# Altium project PCB_Project_1.PrjPcb
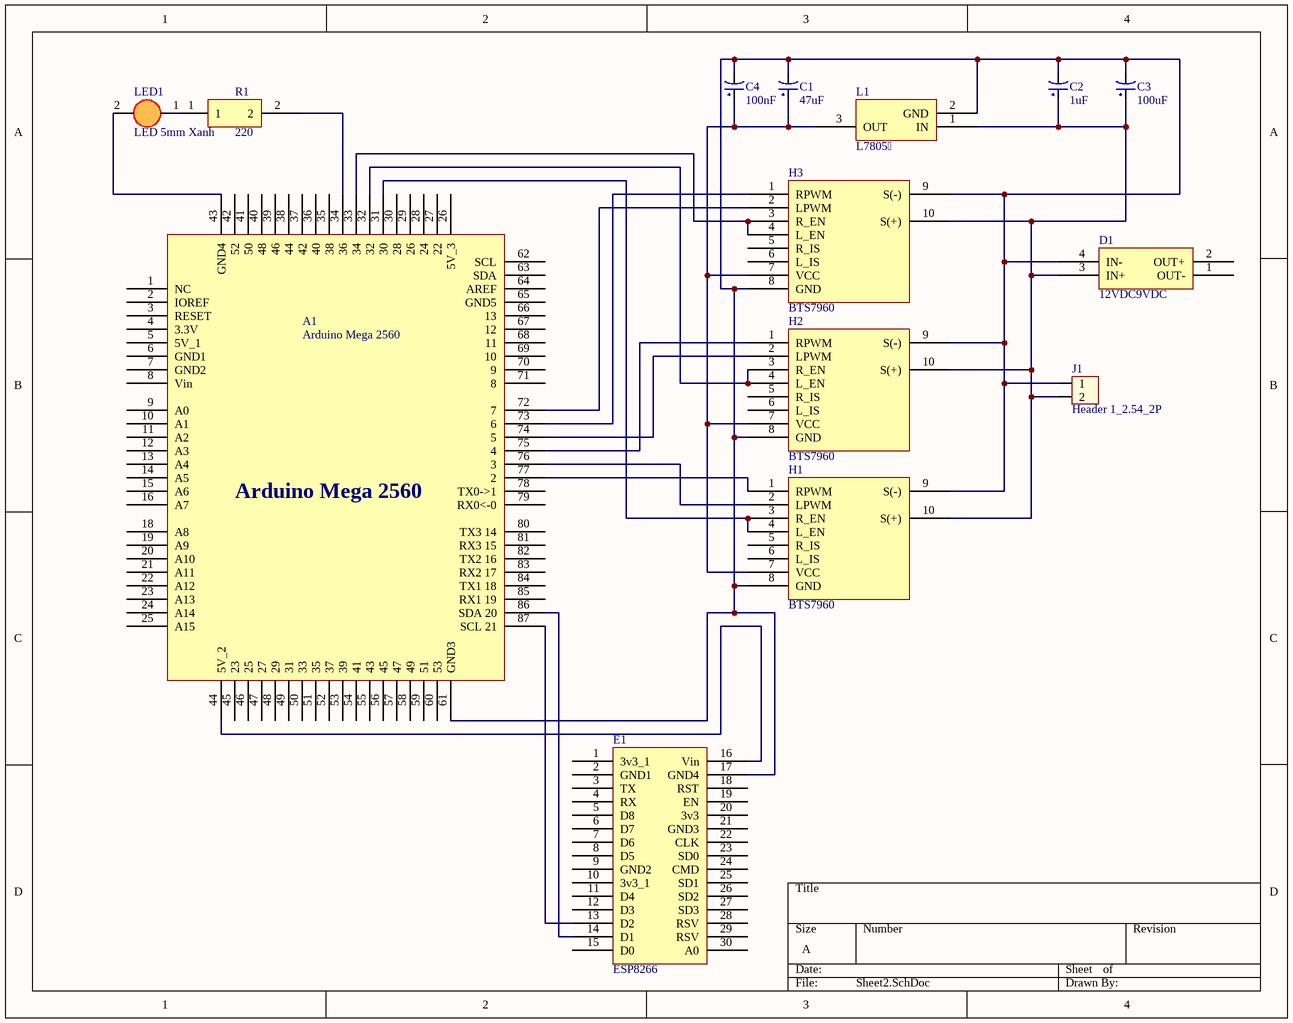
[diagram p0: Sheet2.SchDoc]
1 sheet, 14 parts. Net scope: global (net labels, ports and power ports of the same name join across sheets).
Board file: PCB1.PcbDoc

## Sheet Sheet2.SchDoc
size A; SheetNumber: 1; SheetTotal: 1

### Parts
A1  Arduino Mega 2560  [ArduinoMega2560]
C1  47uF  [tu hoa 5mm]
C2  1uF  [tu hoa 5mm]
C3  100uF  [tu hoa 5mm]
C4  100nF  [tu hoa 5mm]
D1  12VDC9VDC  [LM2596]
E1  ESP8266  [ESP8266]
H1  BTS7960  [BTS7960]
H2  BTS7960  [BTS7960]
H3  BTS7960  [BTS7960]
J1  Header 1_2.54_2P  [Header_Duc Cong_2P 2.54]
L1  L7805  [L7806]
LED1  LED 5mm Xanh  [LED 5mm Xanh]
R1  220  [Res]

### Nets
NetA1_31: A1.31(30) H1.3(R_EN) H1.4(L_EN)
NetA1_32: A1.32 H2.3(R_EN) H2.4(L_EN)
NetA1_33: A1.33(34) H3.3(R_EN) H3.4(L_EN)
NetA1_34: A1.34(36) R1.2
NetA1_43: A1.43(GND4) LED1.2(K)
NetA1_44: A1.44(5V_2) E1.16(Vin)
NetA1_61: A1.61(GND3) C1.2 C2.2 C3.2 C4.2 D1.4(IN-) E1.17(GND4) H1.8(GND) H1.9(S(-)) H2.8(GND) H2.9(S(-)) H3.8(GND) H3.9(S(-)) J1.1 L1.2(GND)
NetA1_72: A1.72(7) H3.2(LPWM)
NetA1_73: A1.73(6) H3.1(RPWM)
NetA1_74: A1.74(5) H2.2(LPWM)
NetA1_75: A1.75(4) H2.1(RPWM)
NetA1_76: A1.76(3) H1.2(LPWM)
NetA1_77: A1.77(2) H1.1(RPWM)
NetA1_86: A1.86(SDA_20) E1.14(D1)
NetA1_87: A1.87(SCL_21) E1.13(D2)
NetC1_1: C1.1 C4.1 H1.7(VCC) H2.7(VCC) H3.7(VCC) L1.3(OUT)
NetC2_1: C2.1 C3.1 D1.3(IN+) H1.10(S(+)) H2.10(S(+)) H3.10(S(+)) J1.2 L1.1(IN)
NetLED1_1: LED1.1(A) R1.1

Not connected (* = marked no-connect by the designer): A1 1(NC) 2(IOREF) 3(RESET) 4(3.3V) 5(5V_1) 6(GND1) 7(GND2) 8(Vin) 9(A0) 10(A1) 11(A2) 12(A3) 13(A4) 14(A5) 15(A6) 16(A7) 18(A8) 19(A9) 20(A10) 21(A11) 22(A12) 23(A13) 24(A14) 25(A15) 26(5V_3) 27(22) 28(24) 29(26) 30(28) 35(38) 36(40) 37(42) 38(44) 39(46) 40(48) 41(50) 42(52) 45(23) 46(25) 47(27) 48(29) 49(31) 50(33) 51(35) 52(37) 53(39) 54(41) 55(43) 56(45) 57(47) 58(49) 59(51) 60(53) 62(SCL) 63(SDA) 64(AREF) 65(GND5) 66(13) 67(12) 68(11) 69(10) 70(9) 71(8) 78(TX0->1) 79(RX0<-0) 80(TX3_14) 81(RX3_15) 82(TX2_16) 83(RX2_17) 84(TX1_18) 85(RX1_19); D1 1(OUT-) 2(OUT+); E1 1(3v3_1) 2(GND1) 3(TX) 4(RX) 5(D8) 6(D7) 7(D6) 8(D5) 9(GND2) 10(3v3_1) 11(D4) 12(D3) 15(D0) 18(RST) 19(EN) 20(3v3) 21(GND3) 22(CLK) 23(SD0) 24(CMD) 25(SD1) 26(SD2) 27(SD3) 28(RSV) 29(RSV) 30(A0); H1 5(R_IS) 6(L_IS); H2 5(R_IS) 6(L_IS); H3 5(R_IS) 6(L_IS)

### Library data of the parts
C1-C4 = Tu Hoa 0.1uF 50V 5x11: Cắm; Don_Vi: Con; So_Chan: 2; Ten_Linh_Kien: Tụ Hóa 0.1uF 50V; Ma_Hang: MH006853; Chung_Loai: Cắm; Kieu_Chan: *
D1 L1 R1 = Component_1
J1 = Header 1_2.54_2P: 12VDC; Chung_Loai: Cắm
LED1 = LED 5mm Xanh: Cắm; Ten_Linh_Kien: Led 5MM Xanh Lá (SS); Ma_Hang: MH002125; Don_Vi: Con; Ghi_Chu: *; Kieu_Chan: *; Chung_Loai: Cắm